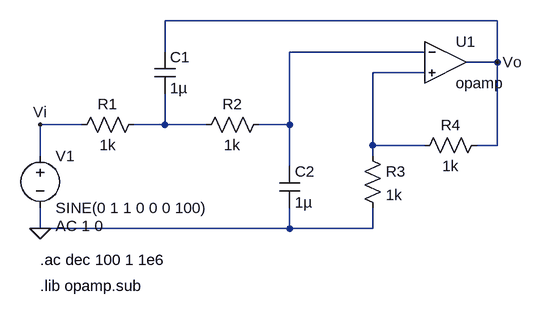
[diagram p0: schematic low_pass.asc]
low_pass.asc, the LTspice schematic file:
Version 4
SHEET 1 880 680
WIRE 608 16 96 16
WIRE 96 64 96 16
WIRE 496 64 288 64
WIRE 608 80 608 16
WIRE 608 80 560 80
WIRE 496 96 416 96
WIRE -32 176 -96 176
WIRE 96 176 96 128
WIRE 96 176 48 176
WIRE 160 176 96 176
WIRE 288 176 288 64
WIRE 288 176 240 176
WIRE 416 208 416 96
WIRE 496 208 416 208
WIRE 608 208 608 80
WIRE 608 208 576 208
WIRE -96 224 -96 176
WIRE 416 224 416 208
WIRE 288 240 288 176
WIRE -96 336 -96 304
WIRE 288 336 288 304
WIRE 288 336 -96 336
WIRE 416 336 416 304
WIRE 416 336 288 336
FLAG -96 336 0
FLAG 608 80 Vo
FLAG -96 176 Vi
SYMBOL res 64 160 R90
WINDOW 0 0 56 VBottom 2
WINDOW 3 32 56 VTop 2
SYMATTR InstName R1
SYMATTR Value 1k
SYMBOL res 256 160 R90
WINDOW 0 0 56 VBottom 2
WINDOW 3 32 56 VTop 2
SYMATTR InstName R2
SYMATTR Value 1k
SYMBOL cap 80 64 R0
SYMATTR InstName C1
SYMATTR Value 1µ
SYMBOL cap 272 240 R0
SYMATTR InstName C2
SYMATTR Value 1µ
SYMBOL res 400 208 R0
SYMATTR InstName R3
SYMATTR Value 1k
SYMBOL res 592 192 R90
WINDOW 0 0 56 VBottom 2
WINDOW 3 32 56 VTop 2
SYMATTR InstName R4
SYMATTR Value 1k
SYMBOL Opamps\\opamp 528 16 R0
SYMATTR InstName U1
SYMBOL voltage -96 208 R0
WINDOW 123 24 124 Left 2
WINDOW 39 0 0 Left 0
SYMATTR InstName V1
SYMATTR Value SINE(0 1 1 0 0 0 100)
SYMATTR Value2 AC 1 0
TEXT -96 384 Left 2 !.ac dec 100 1 1e6
TEXT -96 424 Left 2 !.lib opamp.sub

The netlist it stands for:
* low_pass.asc
R1 N003 Vi 1k
R2 N001 N003 1k
C1 Vo N003 1µ
C2 N001 0 1µ
R3 N002 0 1k
R4 Vo N002 1k
XU1 N001 N002 Vo opamp Aol=100K GBW=10Meg  ; pins invin noninvin out
V1 Vi 0 SINE(0 1 1 0 0 0 100) AC 1 0
.ac dec 100 1 1e6
.lib opamp.sub
.backanno
.end